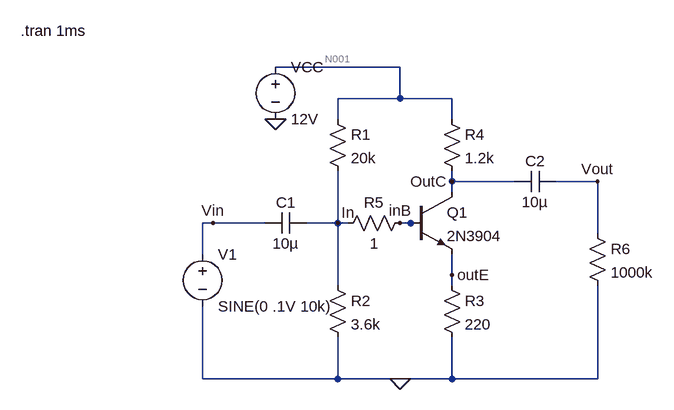
[diagram p0: schematic bjt-amplifier.asc]
bjt-amplifier.asc, the LTspice schematic file:
Version 4
SHEET 1 880 680
WIRE 32 -80 -160 -80
WIRE 32 -32 32 -80
WIRE 32 -32 -64 -32
WIRE 112 -32 32 -32
WIRE -64 0 -64 -32
WIRE 112 0 112 -32
WIRE 112 96 112 80
WIRE 208 96 112 96
WIRE 336 96 272 96
WIRE 112 112 112 96
WIRE -256 160 -272 160
WIRE -176 160 -256 160
WIRE -64 160 -64 80
WIRE -64 160 -112 160
WIRE -48 160 -64 160
WIRE 48 160 32 160
WIRE 64 160 48 160
WIRE 336 176 336 96
WIRE -272 208 -272 160
WIRE 112 240 112 208
WIRE -64 256 -64 160
WIRE 112 256 112 240
WIRE -272 400 -272 288
WIRE -64 400 -64 336
WIRE -64 400 -272 400
WIRE 32 400 -64 400
WIRE 112 400 112 336
WIRE 112 400 32 400
WIRE 336 400 336 256
WIRE 336 400 112 400
FLAG 32 400 0
FLAG 336 96 Vout
FLAG -256 160 Vin
FLAG -160 0 0
FLAG -64 160 In
FLAG 112 96 OutC
FLAG 112 240 outE
FLAG 32 160 inB
SYMBOL npn 48 112 R0
SYMATTR InstName Q1
SYMATTR Value 2N3904
SYMBOL res -80 -16 R0
SYMATTR InstName R1
SYMATTR Value 20k
SYMBOL res -80 240 R0
SYMATTR InstName R2
SYMATTR Value 3.6k
SYMBOL res 96 240 R0
SYMATTR InstName R3
SYMATTR Value 220
SYMBOL res 96 -16 R0
SYMATTR InstName R4
SYMATTR Value 1.2k
SYMBOL voltage -160 -96 R0
SYMATTR InstName VCC
SYMATTR Value 12V
SYMBOL cap -112 144 R90
WINDOW 0 0 32 VBottom 2
WINDOW 3 32 32 VTop 2
SYMATTR InstName C1
SYMATTR Value 10µ
SYMBOL cap 272 80 R90
WINDOW 0 0 32 VBottom 2
WINDOW 3 32 32 VTop 2
SYMATTR InstName C2
SYMATTR Value 10µ
SYMBOL voltage -272 192 R0
WINDOW 123 0 0 Left 0
WINDOW 39 0 0 Left 0
SYMATTR InstName V1
SYMATTR Value SINE(0 .1V 10k)
SYMBOL res 48 144 R90
WINDOW 0 0 56 VBottom 2
WINDOW 3 32 56 VTop 2
SYMATTR InstName R5
SYMATTR Value 1
SYMBOL res 320 160 R0
SYMATTR InstName R6
SYMATTR Value 1000k
TEXT -552 -136 Left 2 !.tran 1ms

The netlist it stands for:
* bjt-amplifier.asc
Q1 OutC inB outE 0 2N3904
R1 N001 In 20k
R2 In 0 3.6k
R3 outE 0 220
R4 N001 OutC 1.2k
VCC N001 0 12V
C1 In Vin 10µ
C2 Vout OutC 10µ
V1 Vin 0 SINE(0 .1V 10k)
R5 inB In 1
R6 Vout 0 1000k
.model NPN NPN
.model PNP PNP
.lib standard.bjt
.tran 1ms
.backanno
.end

* Results of the author's LTspice run, read from the files saved beside the schematic
* Operating Point, zero values left out:
*   V(outc) = 6.097 V
*   V(inb) = 1.782 V
*   V(oute) = 1.086 V
*   V(n001) = 12 V
*   V(in) = 1.782 V
*   Ic(Q1) = 4.919 mA
*   Ib(Q1) = 15.9 µA
*   Ie(Q1) = -4.935 mA
*   I(R1) = 510.9 µA
*   I(R2) = 495 µA
*   I(R3) = 4.935 mA
*   I(R4) = 4.919 mA
*   I(R5) = -15.9 µA
*   I(Vcc) = -5.43 mA
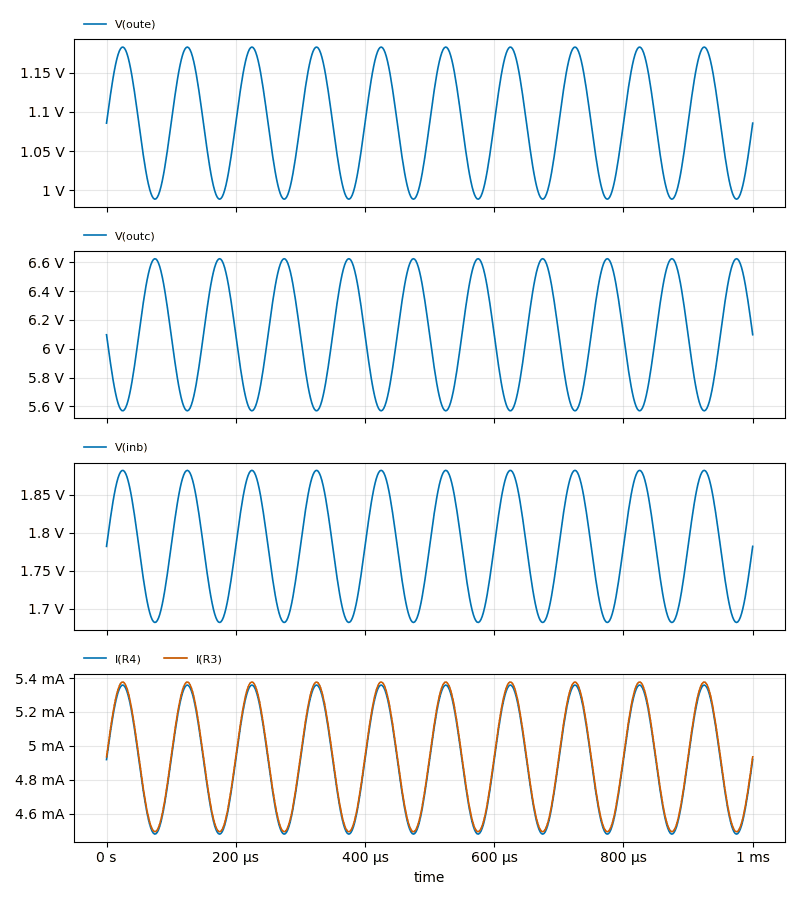
[diagram p1: Transient Analysis of bjt-amplifier.asc, plotted from the saved traces]
* Transient Analysis, 1 run:
*   V(oute): min 988.4 mV, max 1.183 V, average 1.086 V, rms 1.088 V, last 1.086 V
*   V(outc): min 5.569 V, max 6.626 V, average 6.097 V, rms 6.109 V, last 6.098 V
*   V(inb): min 1.682 V, max 1.882 V, average 1.782 V, rms 1.783 V, last 1.782 V
*   I(R4): min 4.479 mA, max 5.359 mA, average 4.919 mA, rms 4.929 mA, last 4.919 mA
*   I(R3): min 4.493 mA, max 5.377 mA, average 4.935 mA, rms 4.945 mA, last 4.935 mA